# Altium schematic sheet ESP32_Pins.SchDoc
size A4; SheetNumber: 2; SheetTotal: 3
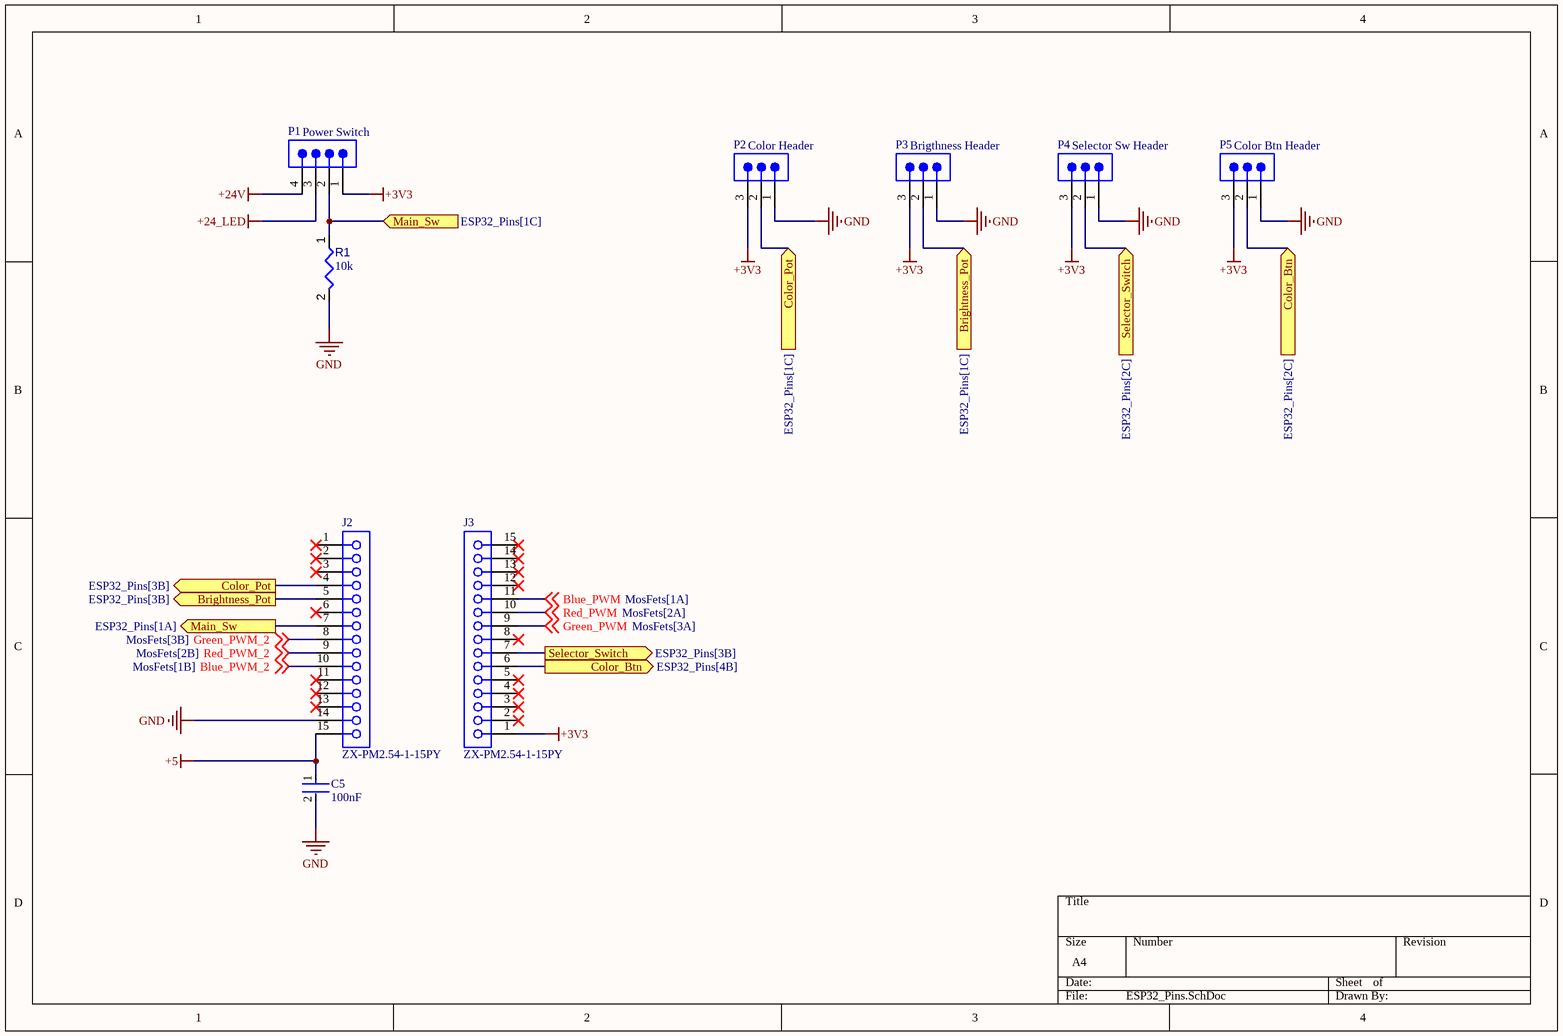
[diagram p0: ESP32_Pins.SchDoc]

## Parts
C5  value 100nF  [FP-CC0603-DA-IPC_B]  (hidden comment: CC0603KRX7R9BB104)
J2  ZX-PM2.54-1-15PY  [68000-115HLF_MFG]
J3  ZX-PM2.54-1-15PY  [68000-115HLF_MFG]
P1  Power Switch  [SMTC-TSW-104-08-X-S]
P2  Color Header  [FP-TSW-103-14-G-S-MFG]
P3  Brigthness Header  [FP-TSW-103-14-G-S-MFG]
P4  Selector Sw Header  [FP-TSW-103-14-G-S-MFG]
P5  Color Btn Header  [FP-TSW-103-14-G-S-MFG]
R1  value 10k  [FP-AC0603-IPC_C]  (hidden comment: 0603WAF1002T5E)

## Ports
Brightness_Pot (in, see ESP32_Pins[1C]), Brightness_Pot (out, see ESP32_Pins[3B]), Color_Btn (in, see ESP32_Pins[2C]), Color_Btn (out, see ESP32_Pins[4B]), Color_Pot (in, see ESP32_Pins[1C]), Color_Pot (out, see ESP32_Pins[3B]), Main_Sw (in, see ESP32_Pins[1C]), Main_Sw (out, see ESP32_Pins[1A]), Selector_Switch (in, see ESP32_Pins[2C]), Selector_Switch (out, see ESP32_Pins[3B])

## Nets
+3V3: J3.1 P1.1 P2.3 P3.3 P4.3 P5.3
+5: C5.1 J2.15
+24_LED: P1.3
+24V: P1.4
GND: C5.2 J2.14 P2.1 P3.1 P4.1 P5.1 R1.2
Blue_PWM: J3.11 ; off-sheet Blue_PWM
Blue_PWM_2: J2.10 ; off-sheet Blue_PWM_2
Brightness_Pot: J2.5 P3.2 ; port Brightness_Pot
Color_Btn: J3.6 P5.2 ; port Color_Btn
Color_Pot: J2.4 P2.2 ; port Color_Pot
Green_PWM: J3.9 ; off-sheet Green_PWM
Green_PWM_2: J2.8 ; off-sheet Green_PWM_2
Main_Sw: J2.7 P1.2 R1.1 ; port Main_Sw
Red_PWM: J3.10 ; off-sheet Red_PWM
Red_PWM_2: J2.9 ; off-sheet Red_PWM_2
Selector_Switch: J3.7 P4.2 ; port Selector_Switch

Not connected (* = marked no-connect by the designer): J2 1* 2* 3* 6* 11* 12* 13*; J3 2* 3* 4* 5* 8* 12* 13* 14* 15*

## Library data of the parts
C5 = CMP-001-00084-1: Multilayer Ceramic Capacitor, CC Series, 0.1 - F, - 10%, X7R, 50 V, 0603 [1608 Metric]; Voltage Rating (DC): 50V; Pins: 2; Case Code (Imperial): 0603; Length: 1.6mm; Case Code (Metric): 1608; Introduction Date: 2005-08-18; Mounting Technology: Surface Mount; Case/Package: 0603; Country of Origin: Mainland China, Taiwan; Voltage Rating: 50V; Dielectric Material: Ceramic; Halogen Free: Halogen Free; Thickness: 889µm; Number of Terminals: 2; Max Operating Temperature: 125°C; REACH SVHC: Yes; Depth: 800µm; Harmonized Tariff Schedule (HTS) Code: 8532.24.00.20; RoHS: Compliant; Width: 800µm; Min Operating Temperature: -55°C; Material: Ceramic; Lifecycle Status: Production; Termination: SMD/SMT; Voltage: 50V; Lead Free: Lead Free; Dielectric: X7R; Tolerance: 10%; Height: 800µm; Radiation Hardening: No; Schedule B: 8532240020, 8532240020; China RoHS: Compliant; Export Control Classification Number (ECCN) Code: EAR99
J2 J3 = CMP-002-00071-2: -40℃~+105℃ 1 15P 1x15P 2.54mm 3.2mm 3A 8.5mm Brass Gold Square Hole Through Hole Top 插件,P=2.54mm Female Headers ROHS; Manufacturer: Megastar; Connector Type: Plugin; Max Current Rating: 3A; MFR.Part #: ZX-PM2.54-1-15PY; Gender: Female; JLCPCB Part #: C7499333; Case/Package: Plugin,P=2.54mm; RoHS Compliant: Yes; Min Operating Temperature: -40°C; Pins: 15; Mounting Technology: Through Hole; Max Operating Temperature: 105°C
P1 = CMP-002-00072-1: Conn Unshrouded Header HDR 4 POS 2.54mm Solder ST Top Entry Thru-Hole Bulk; Connector Type: Male Pin; Max Current Rating: 7.6A; Gender: Male; Min Operating Temperature: -55°C; Case/Package: Plugin,P=2.54mm; Pitch: 2.54mm; Max Operating Temperature: 125°C; Mounting Technology: Throgh Hole; Pins: 4; Contact Material: Bronze
P2-P5 = CMP-002-00074-2: Pin Header, Board-to-Board, 2.54 mm, 1 Rows, 3 Contacts, Through Hole, TSW; Connector Type: Male Pin; Pitch: 2.54mm; Max Current Rating: 7.6A; Gender: Male; Mounting Technology: Through Hole; Max Operating Temperature: 125°C; Min Operating Temperature: -55°C; Pins: 3; Case/Package: Plugin,P=2.54mm
R1 = CMP-009-00177-1: Res Thick Film 0603 10K Ohm 1% 0.1W(1/10W) ±100ppm/C Pad SMD; Tolerance: 5%; Voltage Rating: 75V; Max Operating Temperature: 155°C; Mounting Technology: Surface Mount; Case/Package: 0603; Min Operating Temperature: -55°C